# EAGLE schematic PCEMouse_rev_D (EAGLE 9.6.2)
PC Engine Joypad Breakout Version 1.0
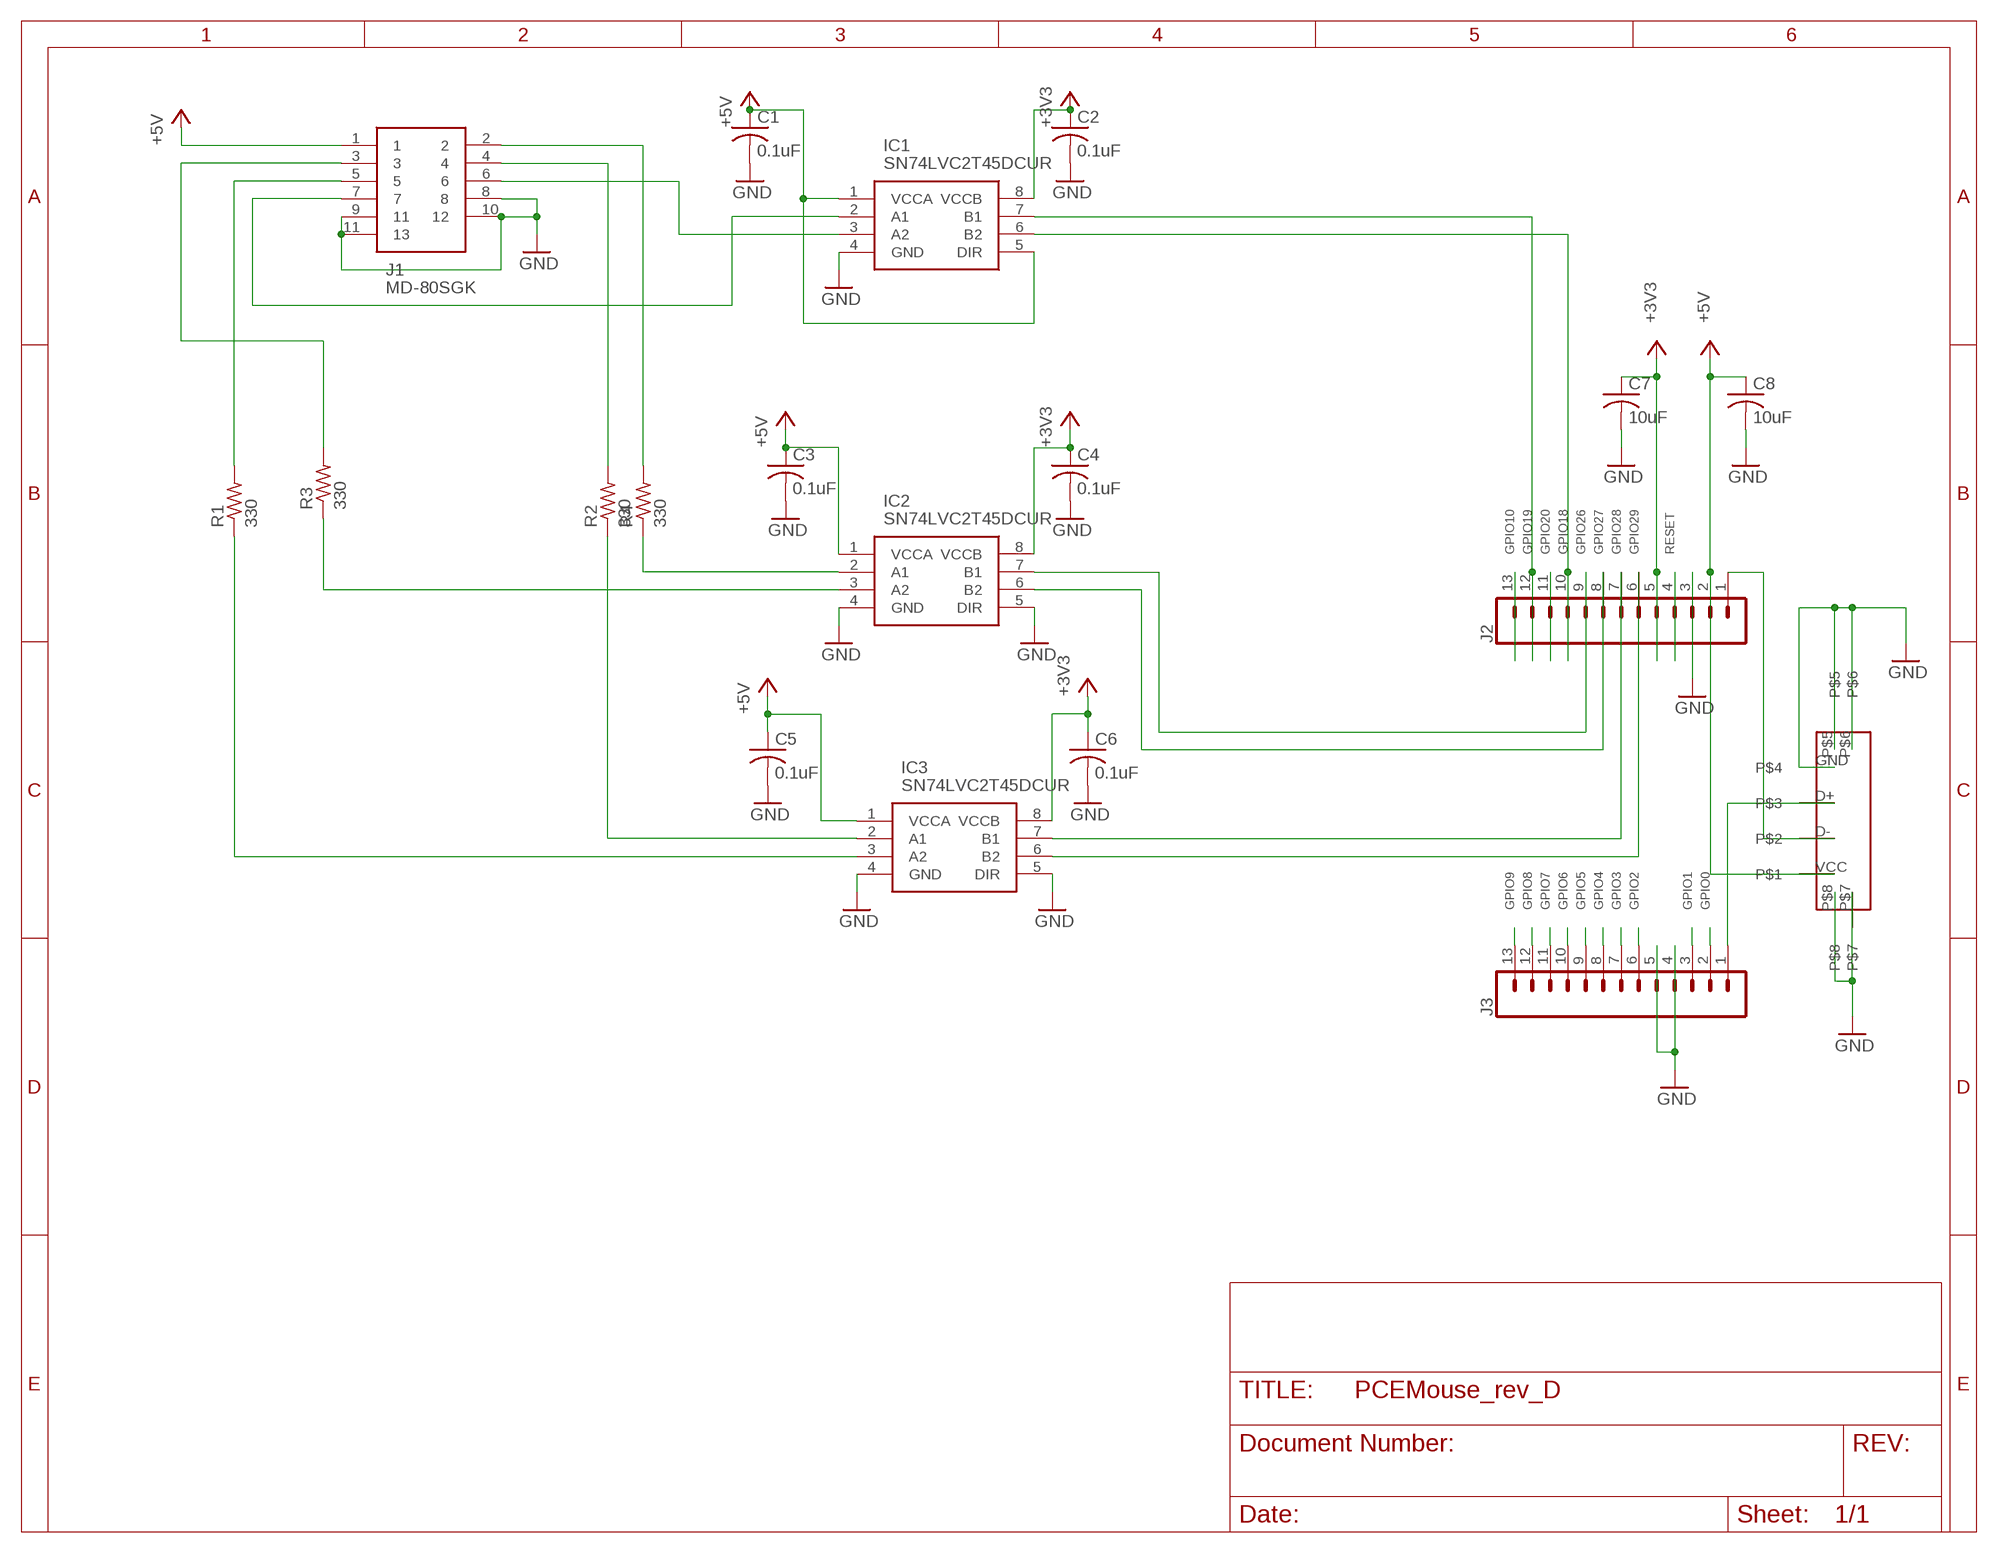
[diagram p0: schematic, sheet 1]

## Parts
C1  0.1uF  C-USC0402  [C0402]
C2  0.1uF  C-USC0402  [C0402]
C3  0.1uF  C-USC0402  [C0402]
C4  0.1uF  C-USC0402  [C0402]
C5  0.1uF  C-USC0402  [C0402]
C6  0.1uF  C-USC0402  [C0402]
C7  10uF  C-USC0805  [C0805]
C8  10uF  C-USC0805  [C0805]
IC1  SN74LVC2T45DCUR  [SOP50P310X90-8N]
IC2  SN74LVC2T45DCUR  [SOP50P310X90-8N]
IC3  SN74LVC2T45DCUR  [SOP50P310X90-8N]
J1  MD-80SGK  [MD80SGK]
J2  CONN_13LONGPADS  [1X13-LONGPADS]
J3  CONN_13LONGPADS  [1X13-LONGPADS]
R1  330  R-US_R0402  [R0402]
R2  330  R-US_R0402  [R0402]
R3  330  R-US_R0402  [R0402]
R4  330  R-US_R0402  [R0402]
U$1  PC-ENGINE_912-312A2021S10100  [PC-ENGINE_912-312A2021S10100]

## Nets
+3V3 [power]: C2.1 C4.1 C6.1 C7.1 IC1.8(VCCB) IC2.8(VCCB) IC3.8(VCCB) J2.5
+5V [power]: C1.1 C3.1 C5.1 C8.1 IC1.1(VCCA) IC1.5(DIR) IC2.1(VCCA) IC3.1(VCCA) J1.1 J2.2 U$1.VCC
CLR [signal]: IC1.2(A1) J1.7
D0_OUT: J1.2 R4.2
D1_OUT: J1.3 R3.2
D2_OUT: J1.4 R2.2
D3_OUT: J1.5 R1.2
GND: C1.2 C2.2 C3.2 C4.2 C5.2 C6.2 C7.2 C8.2 IC1.4(GND) IC2.4(GND) IC2.5(DIR) IC3.4(GND) IC3.5(DIR) J1.8 J1.9 J1.10 J1.11 J2.3 J3.4 J3.5 U$1.GND U$1.P$5 U$1.P$6 U$1.P$7 U$1.P$8
GPIO0: J3.2
GPIO1: J3.3
GPIO2: J3.6
GPIO3: J3.7
GPIO4: J3.8
GPIO5: J3.9
GPIO6: J3.10
GPIO7: J3.11
GPIO8: J3.12
GPIO9: J3.13
GPIO10: J2.13
GPIO18: IC1.6(B2) J2.10
GPIO19: IC1.7(B1) J2.12
GPIO20: J2.11
GPIO26: IC2.7(B1) J2.9
GPIO27: IC2.6(B2) J2.8
GPIO28: IC3.7(B1) J2.7
GPIO29: IC3.6(B2) J2.6
N$1: J3.1 U$1.D+
N$8: IC3.3(A2) R1.1
N$9: IC3.2(A1) R2.1
N$10: IC2.3(A2) R3.1
N$11: IC2.2(A1) R4.1
N$12: J2.1 U$1.D-
RESET: J2.4
SEL [signal]: IC1.3(A2) J1.6

## Library data of the parts
C1-C6 = PC-Engine0402:C-US: CAPACITOR, American symbol
C7 C8 = resistor:C-US: CAPACITOR, American symbol
IC1-IC3 = PC-Engine:SN74LVC2T45DCUR: Texas Instruments SN74LVC2T45DCUR, Voltage Level Translator, Bus Transceiver, 3-State, 1.65 5.5 V, 8-Pin UM Source: Datasheet <http://www.ti.com/lit/gpn/sn74lvc2t45>; ARROW_PART_NUMBER: SN74LVC2T45DCUR; ARROW_PRICE-STOCK: https://www.arrow.com/en/products/sn74lvc2t45dcur/texas-instruments?region=nac; DESCRIPTION: Texas Instruments SN74LVC2T45DCUR, Voltage Level Translator, Bus Transceiver, 3-State, 1.65 5.5 V, 8-Pin UM; HEIGHT: 0.9mm; MANUFACTURER_NAME: Texas Instruments; MANUFACTURER_PART_NUMBER: SN74LVC2T45DCUR; MOUSER_PART_NUMBER: 595-SN74LVC2T45DCUR; MOUSER_PRICE-STOCK: https://www.mouser.co.uk/ProductDetail/Texas-Instruments/SN74LVC2T45DCUR?qs=0smPjiIwnfIdG9vxyJHBdA%3D%3D
J1 = SamacSys_Parts:MD-80SGK: Circular DIN Connectors mini-DIN, 8P jack, rt, through hole, full shield Source: Datasheet <https://www.cui.com/product/resource/md-sgk-series.pdf>; DESCRIPTION: Circular DIN Connectors mini-DIN, 8P jack, rt, through hole, full shield; HEIGHT: 13mm; MANUFACTURER_NAME: CUI; MANUFACTURER_PART_NUMBER: MD-80SGK; MOUSER_PART_NUMBER: 490-MD-80SGK; MOUSER_PRICE-STOCK: https://www.mouser.com/Search/Refine.aspx?Keyword=490-MD-80SGK
J2 J3 = SparkFun-Connectors:CONN_13: Multi connection point. Often used as Generic Header-pin footprint for 0.1 inch spaced/style header connections On any of the 0.1 inch spaced packages, you can populate with these: Break Away Headers - Straight <https://www.sparkfun.com/products/116> (PRT-00116) Break Away Male Headers - Right Angle <https://www.sparkfun.com/products/553> (PRT-00553) Female Headers <https://www.sparkfun.com/products/115> (PRT-00115) Break Away Headers - Machine Pin <https://www.sparkfun.com/products/117> (PRT-00117) Break Away Female Headers - Swiss Machine Pin <https://www.sparkfun.com/products/743> (PRT-00743) For SCREWTERMINALS and SPRING TERMINALS visit here: Screw Terimnals on SparkFun.com <https://www.sparkfun.com/search/results?term=Screw+Terminals> (5mm/3.5mm/2.54mm spacing) This device is also useful as a general connection point to wire up your design to another part of your project. Our various solder wires solder well into these plated through hole pads. Hook-Up Wire - Assortment (Stranded, 22 AWG) <https://www.sparkfun.com/products/11375> (PRT-11375) Hook-Up Wire - Assortment (Solid Core, 22 AWG) <https://www.sparkfun.com/products/11367> (PRT-11367) View the entire wire category on our website here <https://www.sparkfun.com/categories/141> Special notes: Molex polarized connector foot print use with SKU : PRT-08231 with associated crimp pins and housings. 1MM SMD Version SKU: PRT-10208 NOTES ON THE VARIANTS LOCK and LOCK_LONGPADS... This footprint was designed to help hold the alignment of a through-hole component (i.e. 6-pin header) while soldering it into place. You may notice that each hole has been shifted either up or down by 0.005 of an inch from it's more standard position (which is a perfectly straight line). This slight alteration caused the pins (the squares in the middle) to touch the edges of the holes. Because they are alternating, it causes a "brace" to hold the component in place. 0.005 has proven to be the perfect amount of "off-center" position when using our standard breakaway headers. Although looks a little odd when you look at the bare footprint, once you have a header in there, the alteration is very hard to notice. Also,if you push a header all the way into place, it is covered up entirely on the bottom side.
R1-R4 = PC-Engine0402:R-US_: RESISTOR, American symbol
U$1 = PCEMouse_rev_D:PC-ENGINE_912-312A2021S10100

## Net classes
0 default: width 0.152 mm, drill 0.356 mm, clearance 0.152 mm
1 power: width 0.305 mm, drill 0.356 mm, clearance 0.152 mm
2 signal: width 0.152 mm, drill 0.356 mm, clearance 0.152 mm